# EasyEDA Pro project arduino nano adapter board.epro

# Schematic LM393DREOL_1
Board Name: LM393DREOL; Create Date: 2025-11-28; Page Name: P1; Project Name: LM393DREOL; Schematic Name: LM393DREOL; Update Date: 2025-11-29; Company: EasyEDA.com; Page Size: A4; Version: V1.0
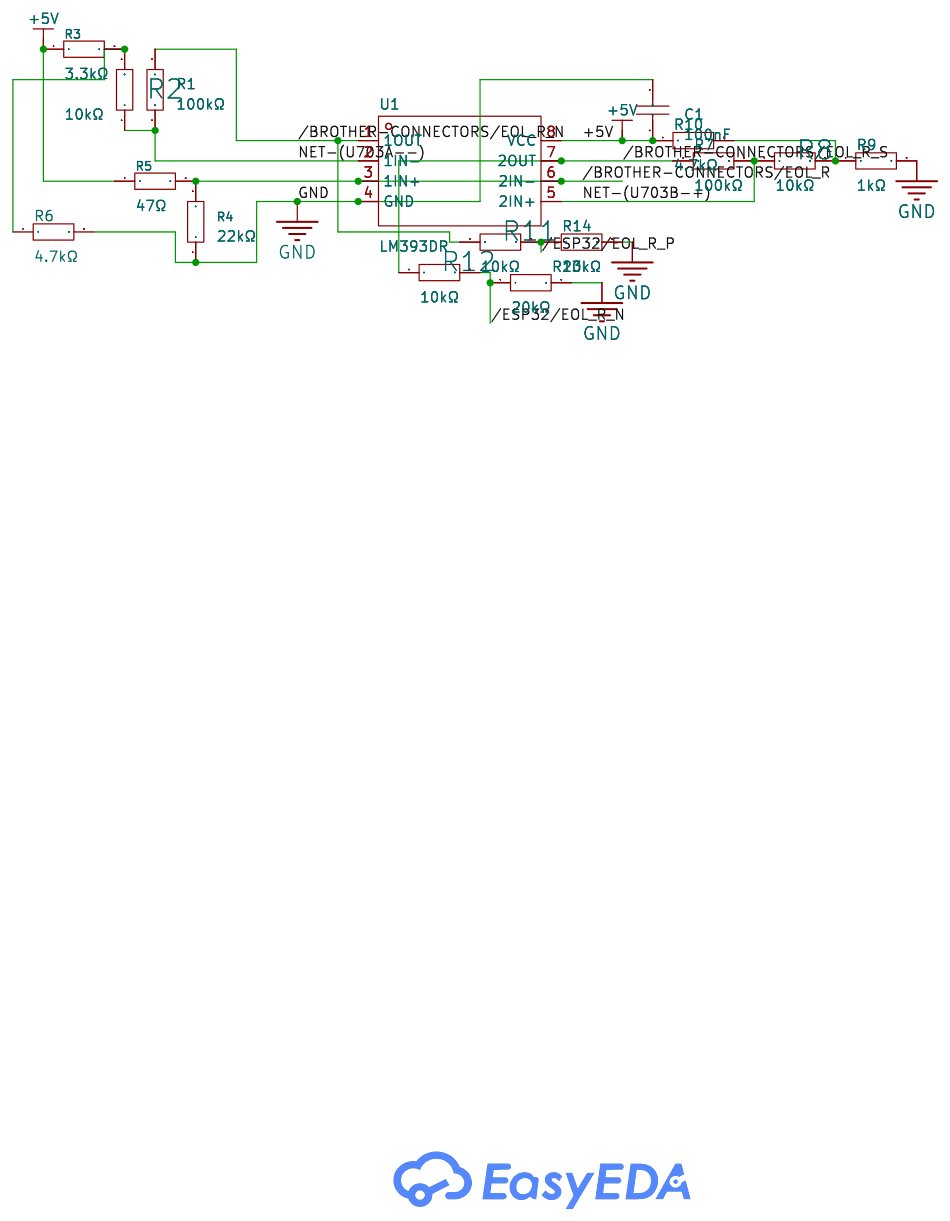
[diagram p0: schematic sheet]

## Parts
C1  100nF  [C0603]
R1  100kΩ  [R0603]
R2  10kΩ  [R0603]
R3  3.3kΩ  [R0603]
R4  22kΩ  [R0603]
R5  47Ω  [R0603]
R6  4.7kΩ  [R0603]
R7  100kΩ  [R0603]
R8  10kΩ  [R0603]
R9  1kΩ  [R0603]
R10  4.7kΩ  [R0603]
R11  10kΩ  [R0603]
R12  10kΩ  [R0603]
R13  20kΩ  [R0603]
R14  20kΩ  [R0603]
U1  LM393DR  [SOIC-8_L5.0-W4.0-P1.27-LS6.0-BL]

## Library data of the parts
C1 = CL10B104KA8NNNC: Capacitance:100nF Tolerance:±10% Tolerance:±10% Voltage Rating:25V Temperature Coefficient:X7R; LCSC Part Name: 100nF ±10% 25V; Supplier Part: C1590; Manufacturer: SAMSUNG(三星); Supplier Footprint: 0603; JLCPCB Part Class: Extended Part; Datasheet: https://item.szlcsc.com/datasheet/CL10B104KA8NNNC/1942.html; Supplier: LCSC; Tolerance: ±10%; Voltage Rating: 25V; Temperature Coefficient: X7R
R1 R7 = 0603WAF1003T5E: Type:Thick Film Resistor Resistance:100kΩ Tolerance:±1% Tolerance:±1% Power(Watts):100mW Voltage-Supply(Max):75V Temperature Coefficient:±100ppm/℃ Temperature Coefficient:±100ppm/℃ Operating Temperature:-55℃~+155℃ Operating Temperature:-55℃~+155℃; LCSC Part Name: 100kΩ ±1% 100mW 厚膜电阻; Supplier Part: C25803; Manufacturer: UNI-ROYAL(厚声); Supplier Footprint: 0603; JLCPCB Part Class: Basic Part; Datasheet: https://item.szlcsc.com/datasheet/0603WAF1003T5E/26546.html; Supplier: LCSC; Type: Thick Film Resistor; Tolerance: ±1%; Power(Watts): 100mW; Voltage-Supply(Max): 75V; Temperature Coefficient: ±100ppm/℃; Operating Temperature: -55℃~+155℃
R2 R8 R11 R12 = 0603WAF1002T5E: Type:Thick Film Resistor Resistance:10kΩ Tolerance:±1% Tolerance:±1% Power(Watts):100mW Voltage-Supply(Max):75V Temperature Coefficient:±100ppm/℃ Temperature Coefficient:±100ppm/℃ Operating Temperature:-55℃~+155℃ Operating Temperature:-55℃~+155℃; LCSC Part Name: 厚膜电阻 10kΩ ±1% 100mW; Supplier Part: C25804; Manufacturer: UNI-ROYAL(厚声); Supplier Footprint: 0603; JLCPCB Part Class: Basic Part; Datasheet: https://item.szlcsc.com/datasheet/0603WAF1002T5E/26547.html; Supplier: LCSC; Type: Thick Film Resistor; Tolerance: ±1%; Power(Watts): 100mW; Voltage-Supply(Max): 75V; Temperature Coefficient: ±100ppm/℃; Operating Temperature: -55℃~+155℃
R3 = 0603WAF3301T5E: Type:Thick Film Resistor Resistance:3.3kΩ Tolerance:±1% Tolerance:±1% Power(Watts):100mW Voltage-Supply(Max):75V Temperature Coefficient:±100ppm/℃ Temperature Coefficient:±100ppm/℃ Operating Temperature:-55℃~+155℃ Operating Temperature:-55℃~+155℃; LCSC Part Name: 3.3kΩ ±1% 100mW 厚膜电阻; Supplier Part: C22978; Manufacturer: UNI-ROYAL(厚声); Supplier Footprint: 0603; JLCPCB Part Class: Basic Part; Datasheet: https://item.szlcsc.com/datasheet/0603WAF3301T5E/23705.html; Supplier: LCSC; Type: Thick Film Resistor; Tolerance: ±1%; Power(Watts): 100mW; Voltage-Supply(Max): 75V; Temperature Coefficient: ±100ppm/℃; Operating Temperature: -55℃~+155℃
R4 = 0603WAF2202T5E: Type:Thick Film Resistor Resistance:22kΩ Tolerance:±1% Tolerance:±1% Power(Watts):100mW Voltage-Supply(Max):75V Temperature Coefficient:±100ppm/℃ Temperature Coefficient:±100ppm/℃ Operating Temperature:-55℃~+155℃ Operating Temperature:-55℃~+155℃; LCSC Part Name: 22kΩ ±1% 100mW 厚膜电阻; Supplier Part: C31850; Manufacturer: UNI-ROYAL(厚声); Supplier Footprint: 0603; JLCPCB Part Class: Basic Part; Datasheet: https://item.szlcsc.com/datasheet/0603WAF2202T5E/32812.html; Supplier: LCSC; Type: Thick Film Resistor; Tolerance: ±1%; Power(Watts): 100mW; Voltage-Supply(Max): 75V; Temperature Coefficient: ±100ppm/℃; Operating Temperature: -55℃~+155℃
R5 = 0603WAF470JT5E: Type:Thick Film Resistor Resistance:47Ω Tolerance:±1% Tolerance:±1% Power(Watts):100mW Voltage-Supply(Max):75V Temperature Coefficient:±100ppm/℃ Temperature Coefficient:±100ppm/℃ Operating Temperature:-55℃~+155℃ Operating Temperature:-55℃~+155℃; LCSC Part Name: 47Ω ±1% 100mW 厚膜电阻; Supplier Part: C23182; Manufacturer: UNI-ROYAL(厚声); Supplier Footprint: 0603; JLCPCB Part Class: Basic Part; Datasheet: https://item.szlcsc.com/datasheet/0603WAF470JT5E/23909.html; Supplier: LCSC; Type: Thick Film Resistor; Tolerance: ±1%; Power(Watts): 100mW; Voltage-Supply(Max): 75V; Temperature Coefficient: ±100ppm/℃; Operating Temperature: -55℃~+155℃
R6 R10 = 0603WAF4701T5E: Type:Thick Film Resistor Resistance:4.7kΩ Tolerance:±1% Tolerance:±1% Power(Watts):100mW Voltage-Supply(Max):75V Temperature Coefficient:±100ppm/℃ Temperature Coefficient:±100ppm/℃ Operating Temperature:-55℃~+155℃ Operating Temperature:-55℃~+155℃; LCSC Part Name: 4.7kΩ ±1% 100mW 厚膜电阻; Supplier Part: C23162; Manufacturer: UNI-ROYAL(厚声); Supplier Footprint: 0603; JLCPCB Part Class: Basic Part; Datasheet: https://item.szlcsc.com/datasheet/0603WAF4701T5E/23889.html; Supplier: LCSC; Type: Thick Film Resistor; Tolerance: ±1%; Power(Watts): 100mW; Voltage-Supply(Max): 75V; Temperature Coefficient: ±100ppm/℃; Operating Temperature: -55℃~+155℃
R9 = 0603WAF1001T5E: Type:Thick Film Resistor Resistance:1kΩ Tolerance:±1% Tolerance:±1% Power(Watts):100mW Voltage-Supply(Max):75V Temperature Coefficient:±100ppm/℃ Temperature Coefficient:±100ppm/℃ Operating Temperature:-55℃~+155℃ Operating Temperature:-55℃~+155℃; LCSC Part Name: 1kΩ ±1% 100mW 厚膜电阻; Supplier Part: C21190; Manufacturer: UNI-ROYAL(厚声); Supplier Footprint: 0603; JLCPCB Part Class: Basic Part; Datasheet: https://item.szlcsc.com/datasheet/0603WAF1001T5E/21904.html; Supplier: LCSC; Type: Thick Film Resistor; Tolerance: ±1%; Power(Watts): 100mW; Voltage-Supply(Max): 75V; Temperature Coefficient: ±100ppm/℃; Operating Temperature: -55℃~+155℃
R13 R14 = 0603WAF2002T5E: Type:Thick Film Resistor Resistance:20kΩ Tolerance:±1% Tolerance:±1% Power(Watts):100mW Voltage-Supply(Max):75V Temperature Coefficient:±100ppm/℃ Temperature Coefficient:±100ppm/℃ Operating Temperature:-55℃~+155℃ Operating Temperature:-55℃~+155℃; LCSC Part Name: 20kΩ ±1% 100mW 厚膜电阻; Supplier Part: C4184; Manufacturer: UNI-ROYAL(厚声); Supplier Footprint: 0603; JLCPCB Part Class: Basic Part; Datasheet: https://item.szlcsc.com/datasheet/0603WAF2002T5E/4591.html; Supplier: LCSC; Type: Thick Film Resistor; Tolerance: ±1%; Power(Watts): 100mW; Voltage-Supply(Max): 75V; Temperature Coefficient: ±100ppm/℃; Operating Temperature: -55℃~+155℃
U1 = LM393DR: Number of Channels:2 Vos - Input Offset Voltage:2mV Ib - Input Bias Current:25nA Propagation Delay Time:1.3us Input Hysteresis Voltage (Vhys):- Common Mode Rejection Ratio(CMRR):- Output Type:- Output Type:TTL；CMOS Quiescent Current:400uA Operating Temper; LCSC Part Name: 双通道差分比较器; Supplier Part: C67470; Manufacturer: TI(德州仪器); Supplier Footprint: SOIC-8; JLCPCB Part Class: Extended Part; Datasheet: https://www.ti.com/cn/lit/gpn/lm393; Supplier: LCSC; Number of Channels: 2; Vos - Input Offset Voltage: 2mV; Ib - Input Bias Current: 25nA; Propagation Delay Time: 1.3us; Output Type: TTL；CMOS; Quiescent Current: 400uA; Operating Temperature: 0℃~+70℃

## Nets
+5V: C1.1 R3.1 R5.1 R10.1 U1.8(VCC)
GND: C1.2 R4.1 R6.2 R9.2 R13.2 R14.2 U1.4(GND)
/BROTHER-CONNECTORS/EOL_R: R4.2 R5.2 U1.3(1IN+) U1.6(2IN-)
/BROTHER-CONNECTORS/EOL_R_N: R1.2 R11.1 U1.1(1OUT)
/BROTHER-CONNECTORS/EOL_R_S: R7.1 R12.1 U1.7(2OUT)
/ESP32/EOL_R_N: R12.2 R13.1
/ESP32/EOL_R_P: R11.2 R14.1
NET-(U703A--): R1.1 R2.1 U1.2(1IN-)
NET-(U703B-+): R7.2 R8.1 U1.5(2IN+)
$1N476: R2.2 R3.2 R6.1
$1N1029: R8.2 R9.1 R10.2

# Board LM393DREOL_1
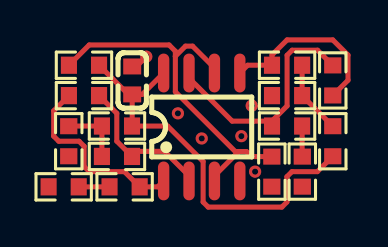
[diagram p1: board, top side]
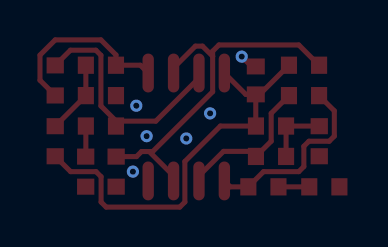
[diagram p2: board, bottom side, seen from below]

No outline. copper layers: Top Layer, Bottom Layer. Coordinates in mm from the lowest, leftmost part position.
Stack: Top Layer 0.035mm / Dielectric1 1.51mm FR4 er 4.5 / Bottom Layer 0.035mm

## Design rules (mm)
template: JLCPCB Capability(Two Layers Board)
spacing copperThickness1oz (default): track to track 0.102, other pairs 0.152 to 0.3
spacing copperThickness2oz: track to track 0.203, other pairs 0.152 to 0.3
track width copperThickness1oz (default): min 0.127, default 0.254, max 2.54
track width copperThickness2oz: min 0.203, default 0.254, max 2.54
differential pair differentialPair (default): width min 0.127, default 0.254, max 2.54; gap min 0.152, default 0.152
via viaSize (default): diameter min 0.5, default 0.61, max 10; hole min 0.3, default 0.305, max 6.3

## Placement (name value [footprint] x y rotation side)
C1  100nF  [C0603]  3.43 5.33 90 top
R1  100kΩ  [R0603]  1.02 4.57 180 top
R2  10kΩ  [R0603]  2.67 1.52 180 top
R3  3.3kΩ  [R0603]  2.67 3.05 180 top
R4  22kΩ  [R0603]  10.41 0.76 90 top
R5  47Ω  [R0603]  1.02 6.1 180 top
R6  4.7kΩ  [R0603]  0.25 2.29 270 top
R7  100kΩ  [R0603]  13.46 5.33 270 top
R8  10kΩ  [R0603]  11.18 6.1 0 top
R9  1kΩ  [R0603]  11.18 4.57 180 top
R10  4.7kΩ  [R0603]  13.46 2.29 90 top
R11  10kΩ  [R0603]  3.05 0 180 top
R12  10kΩ  [R0603]  11.18 3.05 0 top
R13  20kΩ  [R0603]  11.94 0.76 270 top
R14  20kΩ  [R0603]  0 0 180 top
U1  LM393DR  [SOIC-8_L5.0-W4.0-P1.27-LS6.0-BL]  6.91 3 0 top

## Footprints (pads in the part's own frame, mm; a bottom-side part is the same pattern mirrored in y, then rotated)
C0603
  rect 0.8x0.9 smd: 1(-0.7,0) 2(0.7,0)
R0603
  rect 0.806x0.864 smd: 1(-0.753,0) 2(0.753,0)
SOIC-8_L5.0-W4.0-P1.27-LS6.0-BL
  oval 0.569x1.95 smd: 1(-1.905,-2.705) 2(-0.635,-2.705) 3(0.635,-2.705) 4(1.905,-2.705) 5(1.905,2.705) 6(0.635,2.705) 7(-0.635,2.705) 8(-1.905,2.705)

## Nets
As in the schematic.

## Via types
v1: diameter 0.61, hole 0.305, Top Layer to Bottom Layer, 6 vias

## Routing (per net, layer and track width the routed paths; a pad name or vN(x,y) marks a point on that pad's centre or on a via; arc(x,y) is an arc through that point)
+5V: length 20.6
  Top Layer w0.254: R5.1 3.23,4.63 C1.1 ; C1.1 3.43,3.06 R3.1 5.2,3.05 6.98,1.27 6.98,-0.76 7.23,-1.02 10.91,-1.02 11.17,-0.76 11.17,0.51 11.42,0.76 12.69,0.76 R10.1 ; C1.1 3.93,4.63 U1.8
GND: length 0.9
  Top Layer w0.254: 3.43,6.03 3.64,6.03 v1(4.13,6.53)
  vias: v1(5.72,3.68) v1(6.91,2.43) v1(8.89,2.54) v1(9.41,4.07) v1(9.58,0.76)
/BROTHER-CONNECTORS/EOL_R: length 18.9
  Top Layer w0.254: U1.6 7.54,5.96 6.45,7.05 6.09,7.05 5.59,6.55 ; 8.76,1.77 8.58,1.77 5.59,4.77 5.59,6.55 ; 8.76,1.77 9.14,1.77 9.4,1.52 R4.2 ; 8.76,1.77 7.54,0.55 7.54,0.3 ; 5.59,6.55 5.59,6.8 5.27,7.11 1.28,7.11 R5.2
/BROTHER-CONNECTORS/EOL_R_N: length 9.6
  Top Layer w0.254: 5,0.3 4.71,0 R11.1 3.04,0.76 1.28,0.76 1.02,1.02 1.02,2.03 0.77,2.29 -0.25,2.29 -0.5,2.54 -0.5,3.81 R1.2
/BROTHER-CONNECTORS/EOL_R_S: length 11.9
  Top Layer w0.254: R7.1 12.7,6.85 11.43,6.85 11.18,6.6 11.18,4.06 10.41,3.29 ; 10.41,3.29 8.43,3.29 6.35,5.37 6.35,5.63 U1.7 ; 10.41,3.29 10.41,3.06 R12.1
/ESP32/EOL_R_N: length 1.5
  Top Layer w0.254: R13.1 11.93,1.52 R12.2
/ESP32/EOL_R_P: length 1.5
  Top Layer w0.254: R11.2 R14.1
NET-(U703A--): length 7.5
  Top Layer w0.254: 6.27,0.3 6.27,0.55 5.04,1.78 3.67,1.78 R2.1 2.66,2.29 2.66,3.68 R1.1
NET-(U703B-+): length 9.1
  Top Layer w0.254: R7.2 14.22,5.34 14.22,6.6 13.46,7.37 11.18,7.37 10.42,6.61 R8.1 9.2,6.1 U1.5
$1N476: length 3.2
  Top Layer w0.254: R6.1 0.26,3.05 R3.2 R2.2
$1N1029: length 3.7
  Top Layer w0.254: R10.2 R9.1 R8.2

# Board PCB1
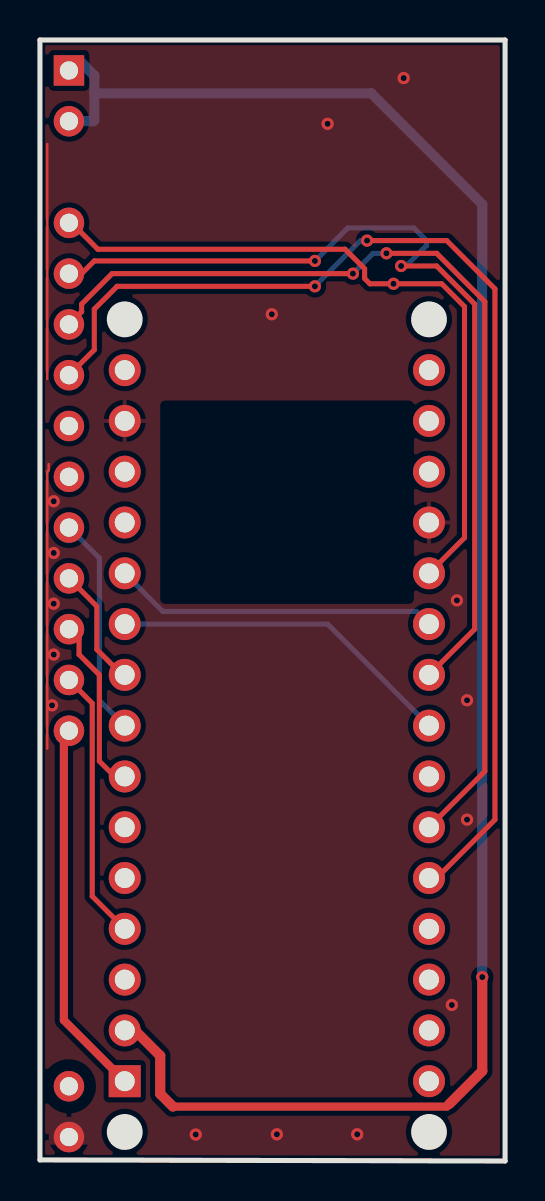
[diagram p3: board, top side]
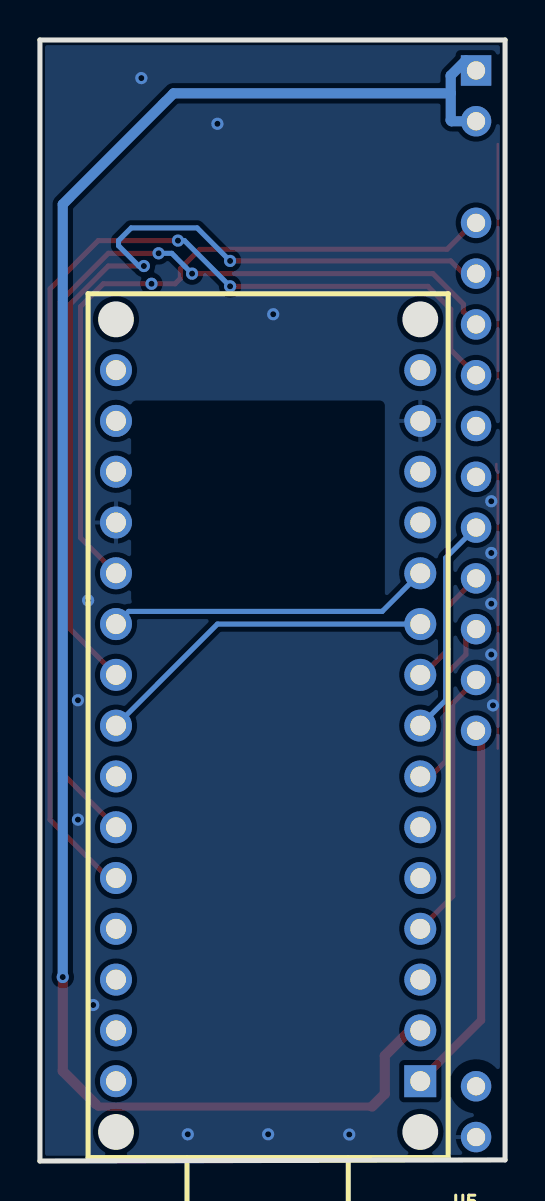
[diagram p4: board, bottom side, seen from below]

Outline 23.3 x 56.06 mm; copper layers: Top Layer, Bottom Layer. Coordinates in mm from the lower left corner of the outline.
Outline path: 0,56.06 0,0.05 23.3,0 23.3,56.06 0,56.06
Stack: Top Layer 0.035mm / Dielectric1 1.51mm FR4 er 4.5 / Bottom Layer 0.035mm

## Design rules (mm)
template: JLCPCB Capability(Two Layers Board)
spacing copperThickness1oz (default): track to track 0.102, other pairs 0.152 to 0.3
spacing copperThickness2oz: track to track 0.203, other pairs 0.152 to 0.3
track width copperThickness1oz (default): min 0.127, default 0.254, max 2.54
track width copperThickness2oz: min 0.203, default 0.254, max 2.54
differential pair differentialPair (default): width min 0.127, default 0.254, max 2.54; gap min 0.152, default 0.152
via viaSize (default): diameter min 0.5, default 0.61, max 10; hole min 0.3, default 0.305, max 6.3

## Placement (name value [footprint] x y rotation side)
NOREF  -  [Pad_e6325]  1.45 26.6 0 top
NOREF#2  -  [Pad_e6333]  1.45 46.92 0 top
NOREF#3  -  [Pad_e6324]  1.45 24.06 0 top
NOREF#4  -  [Pad_e6335]  1.45 54.54 0 top
NOREF#5  -  [Pad_e6330]  1.45 39.3 0 top
NOREF#6  -  [Pad_e6332]  1.45 44.38 0 top
NOREF#7  -  [Pad_e6326]  1.45 29.14 0 top
NOREF#8  -  [Pad_e6334]  1.45 52 0 top
NOREF#9  -  [Pad_e6323]  1.45 21.52 0 top
NOREF#10  -  [Pad_e6331]  1.45 41.84 0 top
NOREF#11  -  [Pad_e6327]  1.45 31.68 0 top
NOREF#12  -  [Pad_e6322]  1.45 1.2 0 top
NOREF#13  -  [Pad_e6329]  1.45 36.76 0 top
NOREF#14  -  [Pad_e6328]  1.45 34.22 0 top
NOREF#15  -  [Pad_e6321]  1.45 3.74 0 top
U5  ABX00028  [MOD-TH_ABX00028]  11.87 21.77 0 bottom

## Footprints (pads in the part's own frame, mm; a bottom-side part is the same pattern mirrored in y, then rotated)
MOD-TH_ABX00028
  rect 1.6x1.6 hole 1: 1(-7.62,17.78)
  round 1.6 hole 1: 2(-7.62,15.24) 3(-7.62,12.7) 4(-7.62,10.16) 5(-7.62,7.62) 6(-7.62,5.08) 7(-7.62,2.54) 8(-7.62,0) 9(-7.62,-2.54) 10(-7.62,-5.08) 11(-7.62,-7.62) 12(-7.62,-10.16) 13(-7.62,-12.7) 14(-7.62,-15.24) 15(-7.62,-17.78) 16(7.62,-17.78) 17(7.62,-15.24) 18(7.62,-12.7) 19(7.62,-10.16) 20(7.62,-7.62) 21(7.62,-5.08) 22(7.62,-2.54) 23(7.62,0) 24(7.62,2.54) 25(7.62,5.08) 26(7.62,7.62) 27(7.62,10.16) 28(7.62,12.7) 29(7.62,15.24) 30(7.62,17.78)
Pad_e6321
  round 1.524 hole 0.914: 1(0,0)
Pad_e6322
  round 1.524 hole 0.914: 1(0,0)
Pad_e6323
  round 1.524 hole 0.914: 1(0,0)
Pad_e6324
  round 1.524 hole 0.914: 1(0,0)
Pad_e6325
  round 1.524 hole 0.914: 1(0,0)
Pad_e6326
  round 1.524 hole 0.914: 1(0,0)
Pad_e6327
  round 1.524 hole 0.914: 1(0,0)
Pad_e6328
  round 1.524 hole 0.914: 1(0,0)
Pad_e6329
  round 1.524 hole 0.914: 1(0,0)
Pad_e6330
  round 1.524 hole 0.914: 1(0,0)
Pad_e6331
  round 1.524 hole 0.914: 1(0,0)
Pad_e6332
  round 1.524 hole 0.914: 1(0,0)
Pad_e6333
  round 1.524 hole 0.914: 1(0,0)
Pad_e6334
  round 1.524 hole 0.914: 1(0,0)
Pad_e6335
  rect 1.524x1.524 hole 0.914: 1(0,0)

## Nets
+3V3: NOREF#4.1 NOREF#8.1 U5.2
+5V: NOREF#15.1
GND: NOREF#12.1 U5.14 U5.19
/AUX-CONNECTORS/AYAB_SCL: NOREF#7.1 U5.9
/AUX-CONNECTORS/AYAB_SDA: NOREF#11.1 U5.8
/ESP32/ENC_A: NOREF#3.1 U5.4
/ESP32/ENC_B: NOREF#9.1 U5.1
/ESP32/ENC_BP: NOREF.1 U5.7
/ESP32/EOL_L_N: NOREF#10.1 U5.25
/ESP32/EOL_L_P: NOREF#5.1 U5.26
/ESP32/EOL_R_N: NOREF#2.1 U5.20
/ESP32/EOL_R_P: NOREF#6.1 U5.22
BUZZER: U5.10 U5.23
SPARE: U5.11 U5.21

Pads without a net: NOREF#13 1; NOREF#14 1; U5 3 5 6 12 13 15 16 17 18 24 27 28 29 30

## Via types
v1: diameter 0.61, hole 0.305, Top Layer to Bottom Layer, 23 vias

## Routing (per net, layer and track width the routed paths; a pad name or vN(x,y) marks a point on that pad's centre or on a via; arc(x,y) is an arc through that point)
+3V3: length 91
  Top Layer w0.406: 20.5,2.85 20.38,2.72 6.66,2.72
  Top Layer w0.508: 6.66,2.72 6.02,3.36 6.02,5.26 4.75,6.53 U5.2 ; v1(22.15,9.2) 22.15,4.5 20.5,2.85
  Bottom Layer w0.508: v1(22.15,9.2) 22.15,47.84 16.6,53.39 2.72,53.39 ; 2.72,53.39 2.72,52.04 2.68,52 NOREF#8.1 ; 2.72,53.39 2.72,54.28 1.96,55.05
GND: length 26
  Top Layer w0.127: 0.36,39.12 0.36,50.85 ; 0.44,34.85 0.44,34.54 0.36,34.47 0.36,20.63
  vias: v1(0.61,22.79) v1(0.69,32.99) v1(0.69,30.41) v1(0.69,27.87) v1(0.69,25.33) v1(7.8,1.32) v1(11.61,42.35) v1(11.87,1.34) v1(14.41,51.87) v1(15.89,1.34) v1(18.22,54.16) v1(20.63,7.8) v1(20.88,28.04) v1(21.39,23.04) v1(21.39,17.07)
/AUX-CONNECTORS/AYAB_SCL: length 6.1
  Top Layer w0.254: U5.9 4.12,24.31 2.85,25.58 2.85,27.74 NOREF#7.1
/AUX-CONNECTORS/AYAB_SDA: length 11.1
  Bottom Layer w0.254: U5.8 2.98,23.04 2.98,30.15 NOREF#11.1
/ESP32/ENC_A: length 13.6
  Top Layer w0.254: U5.4 2.62,13.24 2.62,22.89 NOREF#3.1
/ESP32/ENC_B: length 18.9
  Top Layer w0.406: U5.1 1.2,7.04 1.2,21.26 NOREF#9.1
/ESP32/ENC_BP: length 8.8
  Top Layer w0.254: NOREF.1 1.96,26.09 1.96,25.33 2.98,24.31 2.98,19.99 3.74,19.23 U5.7
/ESP32/EOL_L_N: length 51
  Top Layer w0.254: v1(17.35,45.39) 19.87,45.39 22.28,42.98 22.28,19.49 U5.25 ; NOREF#10.1 2.09,42.47 2.09,42.85 3.61,44.38 v1(15.68,44.38)
  Bottom Layer w0.254: v1(17.35,45.39) 16.69,45.39 v1(15.68,44.38)
/ESP32/EOL_L_P: length 57.1
  Top Layer w0.254: U5.26 19.87,14.15 22.79,17.07 22.79,43.62 20.38,46.03 v1(16.38,46.03) ; 13.52,43.74 3.87,43.74 2.72,42.6 2.72,40.57 NOREF#5.1
  Bottom Layer w0.254: v1(16.38,46.03) 16.06,46.03 v1(13.77,43.74)
/ESP32/EOL_R_N: length 35.9
  Top Layer w0.254: NOREF#2.1 1.58,46.92 2.9,45.6 15.28,45.6 16.26,44.62 16.26,44.14 16.53,43.87 v1(17.71,43.87) 20.12,43.87 21.26,42.73 21.26,31.17 U5.20
/ESP32/EOL_R_P: length 45
  Top Layer w0.254: U5.22 21.77,26.6 21.77,42.85 19.87,44.76 v1(18.09,44.76) ; NOREF#6.1 2.09,44.38 2.72,45.01 v1(13.77,45.01)
  Bottom Layer w0.254: v1(13.77,45.01) 15.42,46.66 18.72,46.66 19.36,46.03 19.36,45.77 18.34,44.76 v1(18.09,44.76)
BUZZER: length 17.3
  Bottom Layer w0.254: U5.10 14.41,26.85 U5.23
SPARE: length 16.3
  Bottom Layer w0.254: U5.21 18.85,27.49 6.15,27.49 U5.11

## Copper pours and planes (outline as drawn; the poured copper is in the pictures)
GND on Top Layer: 0.44,2.21 2.47,2.21 2.47,0.82 0.44,0.82
GND on Top Layer: -56.97,71.43 52.63,71.43 52.63,-12.65 -56.97,-12.65
GND on Bottom Layer: -45.79,58.47 36.76,58.47 36.76,-1.72 -45.79,-1.72
